# Altium schematic sheet Amplifiers.SchDoc
size A4
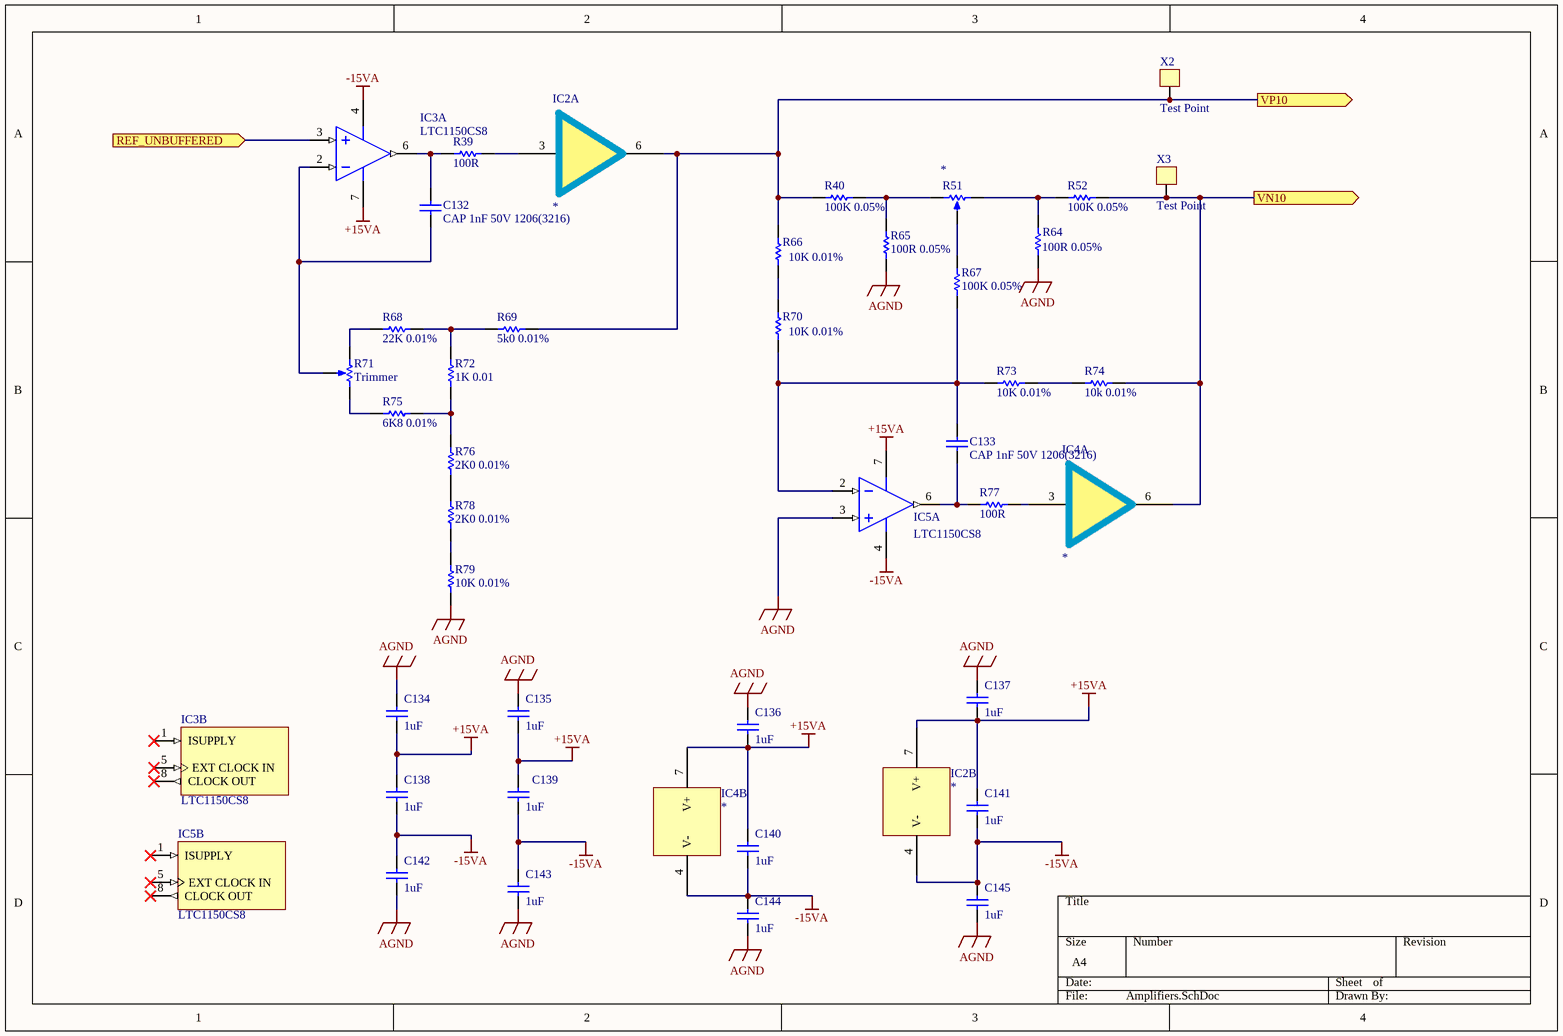
[diagram p0: Amplifiers.SchDoc]

## Parts
C132  CAP 1nF 50V 1206(3216)  [CAPC1206(3216)100_N]
C133  CAP 1nF 50V 1206(3216)  [CAPC1206(3216)100_N]
C134  value 1uF  [CAPC1206(3216)110_N]  (hidden comment: CAP 1uF 50V 1206(3216))
C135  value 1uF  [CAPC1206(3216)110_N]  (hidden comment: CAP 1uF 50V 1206(3216))
C136  value 1uF  [CAPC1206(3216)110_N]  (hidden comment: CAP 1uF 50V 1206(3216))
C137  value 1uF  [CAPC1206(3216)110_N]  (hidden comment: CAP 1uF 50V 1206(3216))
C138  value 1uF  [CAPC1206(3216)110_N]  (hidden comment: CAP 1uF 50V 1206(3216))
C139  value 1uF  [CAPC1206(3216)110_N]  (hidden comment: CAP 1uF 50V 1206(3216))
C140  value 1uF  [CAPC1206(3216)110_N]  (hidden comment: CAP 1uF 50V 1206(3216))
C141  value 1uF  [CAPC1206(3216)110_N]  (hidden comment: CAP 1uF 50V 1206(3216))
C142  value 1uF  [CAPC1206(3216)110_N]  (hidden comment: CAP 1uF 50V 1206(3216))
C143  value 1uF  [CAPC1206(3216)110_N]  (hidden comment: CAP 1uF 50V 1206(3216))
C144  value 1uF  [CAPC1206(3216)110_N]  (hidden comment: CAP 1uF 50V 1206(3216))
C145  value 1uF  [CAPC1206(3216)110_N]  (hidden comment: CAP 1uF 50V 1206(3216))
IC2  *  [SO8_L]  (parts A,B of 3)
IC3  LTC1150CS8  [LT-S8-8_M]  (parts A,B of 2)
IC4  *  [SO8_L]  (parts A,B of 3)
IC5  LTC1150CS8  [LT-S8-8_M]  (parts A,B of 2)
R39  100R  [RESC0805(2012)_N]
R40  100K 0.05%  [RESC0805(2012)_N]
R51  *  [TrimPot]
R52  100K 0.05%  [RESC0805(2012)_N]
R64  100R 0.05%  [RESC0805(2012)_N]
R65  100R 0.05%  [RESC0805(2012)_N]
R66  10K 0.01%  [RESC3116X65X40LL10T20]
R67  100K 0.05%  [RESC0805(2012)_N]
R68  22K 0.01%  [RESC0805(2012)_N]
R69  5k0 0.01%  [RESC0805(2012)_N]
R70  10K 0.01%  [RESC3116X65X40LL10T20]
R71  Trimmer  [TrimPot]
R72  1K 0.01  [RESC3116X65X40LL10T20]
R73  10K 0.01%  [RESC3116X65X40LL10T20]
R74  10k 0.01%  [RESC3116X65X40LL10T20]
R75  6K8 0.01%  [RESC0805(2012)_N]
R76  2K0 0.01%  [RESC0805(2012)_N]
R77  100R  [RESC0805(2012)_N]
R78  2K0 0.01%  [RESC0805(2012)_N]
R79  10K 0.01%  [RESC3116X65X40LL10T20]
X2  Test Point  [Test Point]
X3  Test Point  [Test Point]

## Ports
REF_UNBUFFERED (in), VN10 (out), VP10 (out)

## Nets
+15VA: C134.1 C135.1 C136.1 C137.1 C138.2 C139.2 C140.2 C141.2 IC2.7(V+) IC3.7(V+) IC4.7(V+) IC5.7(V+)
-15VA: C138.1 C139.1 C140.1 C141.1 C142.2 C143.2 C144.2 C145.2 IC2.4(V-) IC3.4(V-) IC4.4(V-) IC5.4(V-)
AGND: C134.2 C135.2 C136.2 C137.2 C142.1 C143.1 C144.1 C145.1 IC5.3(+IN) R64.2 R65.2 R79.1
REF_UNBUFFERED: IC3.3(+IN) ; port REF_UNBUFFERED
VN10: IC4.6(Out) R52.2 R74.1 X3.1 ; port VN10
VP10: IC2.6(Out) R40.1 R66.2 R69.2 X2.1 ; port VP10
NetC132_1: C132.1 IC3.6(OUT) R39.1
NetC132_2: C132.2 IC3.2(-IN) R71.3(TAP)
NetC133_1: C133.1 IC5.2(-IN) R67.1 R70.1 R73.2
NetC133_2: C133.2 IC5.6(OUT) R77.1
NetIC2_3: IC2.3(In) R39.2
NetIC4_3: IC4.3(In) R77.2
NetR40_2: R40.2 R51.1(TOP) R65.1
NetR51_2: R51.2(BOT) R52.1 R64.1
NetR51_3: R51.3(TAP) R67.2
NetR66_1: R66.1 R70.2
NetR68_1: R68.1 R71.1(TOP)
NetR68_2: R68.2 R69.1 R72.2
NetR71_2: R71.2(BOT) R75.1
NetR72_1: R72.1 R75.2 R76.2
NetR73_1: R73.1 R74.2
NetR76_1: R76.1 R78.2
NetR78_1: R78.1 R79.2

Not connected (* = marked no-connect by the designer): IC3 1(ISUPPLY)* 5(EXT_CLOCK_IN)* 8(CLOCK_OUT)*; IC5 1(ISUPPLY)* 5(EXT_CLOCK_IN)* 8(CLOCK_OUT)*

## Library data of the parts
C132 C133 = CMP-1037-02455-1: CAP 1nF 50V ±20% 1206 (3216 Metric) Thickness 1mm SMD; Case-Metric: 3216; Tolerance: Â±20%; Case-EIA: 1206; Rated Voltage: 50 V; Value: 1nF; Max Thickness: 1 mm; Technology: SMT
C134-C145 = CMP-1037-04724-1: CAP 1uF 50V -20% to +80% 1206 (3216 Metric) Thickness 1.05mm SMD; Case-EIA: 1206; Case-Metric: 3216; Rated Voltage: 50 V; Tolerance: -20% to +80%; Max Thickness: 1.05 mm; Technology: SMT
IC2 IC4 = BUF634
IC3 IC5 = CMP-0359-03090-2: Single Channel, Zero-Drift Operational Amplifier with Internal Capacitors, 2.5 MHz Typical GBW, 3 V/us Typical SR, 4.75 to 32 V, 8-Pin SOIC (S8-8), Commercial; Manufacturer: Linear Technology; GBW (MHz) Typical: 2.5; SR (V/us) Typical: 3; Is (mA) Typical: 0.8; Vos (mV) Typical: 0.0005; Channels (#): 1; Vs Min (V): 4.75; Vs Max (V): 32; ComponentLink3Description: Package Specification; PackageReference: LT-S8-8; DatasheetVersion: Rev. B; PartNumber: LTC1150CS8; Mounting Technology: Surface Mount; ComponentLink1Description: Manufacturer URL; RevisionNote: URLs updated; ComponentLink2URL: http://cds.linear.com/docs/en/datasheet/1150fb.pdf; PackageVersion: Rev G; ComponentLink1URL: http://www.linear.com/; ComponentLink3URL: http://cds.linear.com/docs/en/packaging/05081610_G_SO8.pdf; Linear Technology Part Number: LTC1150; Type: ZD; PackageDescription: 8-Pin Plastic Small Outline, Body 4.9 x 3.9 mm, Pitch 1.27 mm; ComponentLink2Description: Datasheet
R39 R40 R52 R64 R65 R67-R69 R75-R78 = CMP-1013-00849-1: 1M 0.125W 1% 0805 (2012 Metric)  SMD; Value: 1000000.00 Ohm; Case-Metric: 2012; Case-EIA: 0805; Technology: SMT; Power: 0.125 W; Tolerance: 1 %
R51 R71 = Vishay Trimmer
R66 R70 R72-R74 R79 = CMP-2003-03538-1: Manufacturer: Yageo; Part Number: RC1206FR-0710K2L